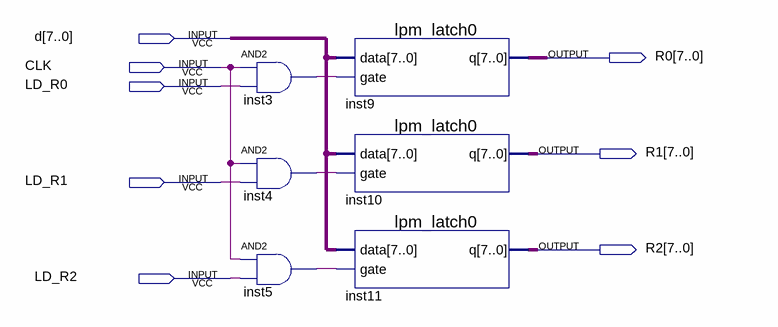
[diagram p0: schematic sheet]
// Quartus schematic REG0_2.bdf as structural Verilog: 6 symbols, 8 pins
module REG0_2 (
  input  [7:0] d,
  input  CLK,
  input  LD_R0,
  input  LD_R1,
  input  LD_R2,
  output [7:0] R0,
  output [7:0] R1,
  output [7:0] R2
);

  wire inst3_out, inst4_out, inst5_out;

  and inst3 (inst3_out, CLK, LD_R0);
  and inst4 (inst4_out, CLK, LD_R1);
  and inst5 (inst5_out, CLK, LD_R2);
  lpm_latch0 inst9 (.data(d), .gate(inst3_out), .q(R0));
  lpm_latch0 inst10 (.data(d), .gate(inst4_out), .q(R1));
  lpm_latch0 inst11 (.data(d), .gate(inst5_out), .q(R2));
endmodule
